# Altium schematic sheet stm32f103.SchDoc
size A4
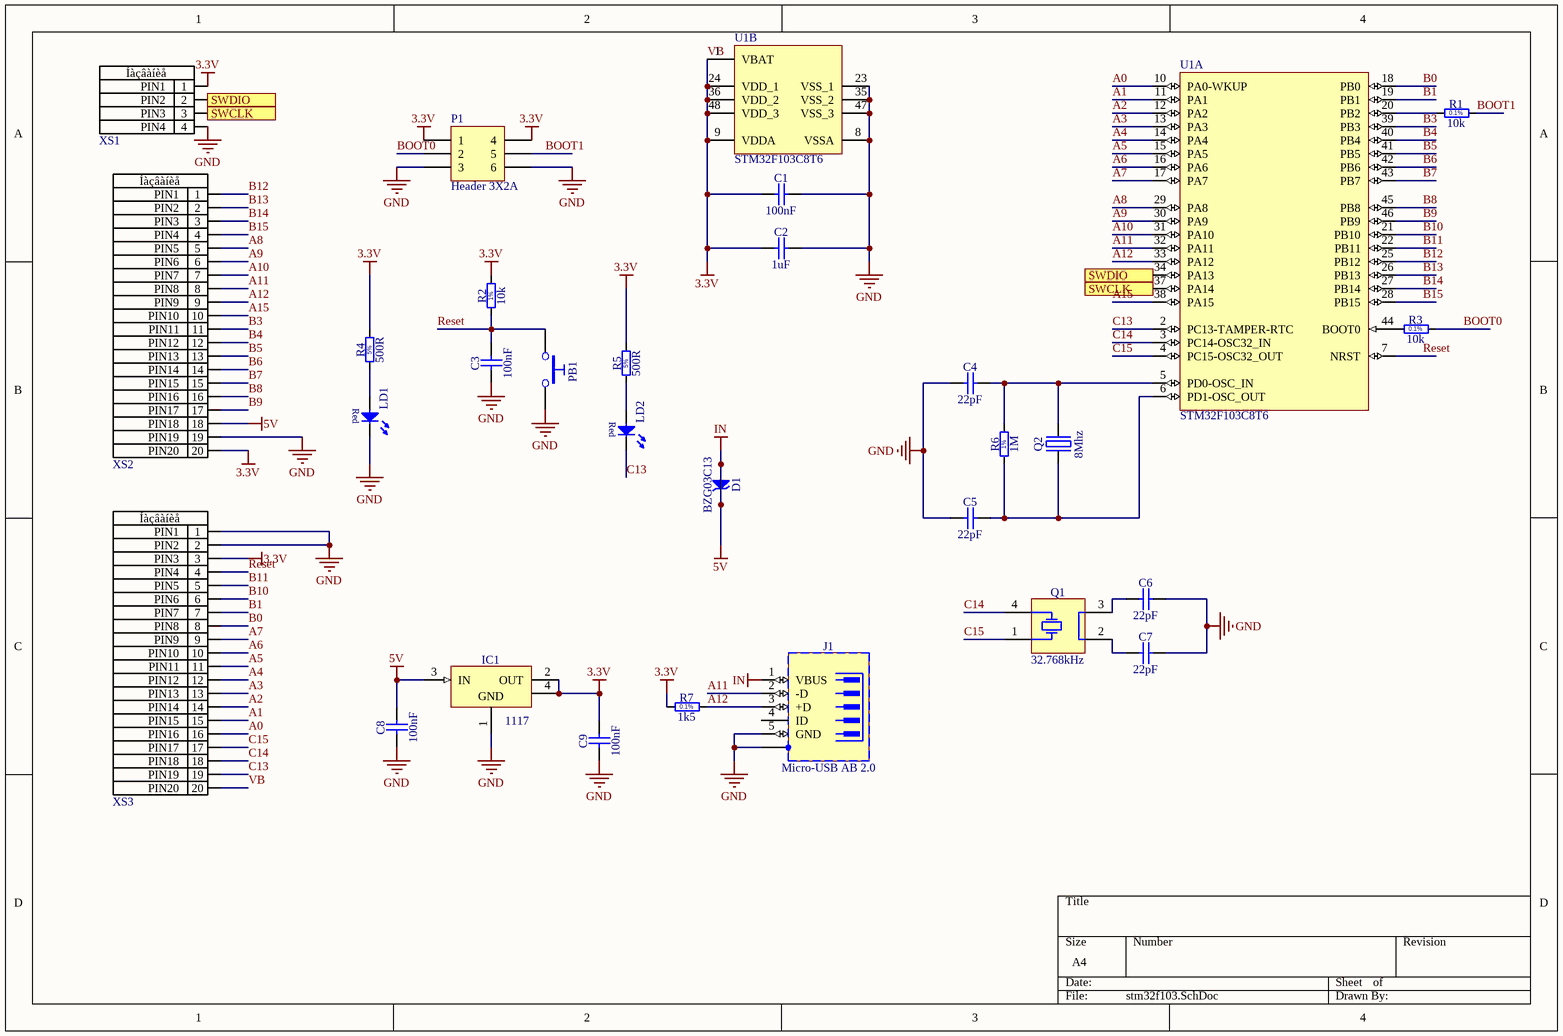
[diagram p0: stm32f103.SchDoc]

## Parts
C1  100nF  [CAPC3216X140N]
C2  1uF  [CAPC3216X140N]
C3  100nF  [CAPC3216X140N]
C4  22pF  [CAPC3216X140N]
C5  22pF  [CAPC3216X140N]
C6  22pF  [CAPC3216X140N]
C7  22pF  [CAPC3216X140N]
C8  100nF  [CAPC3216X140N]
C9  100nF  [CAPC3216X140N]
D1  BZG03C13  [DIOM5326X230N]
IC1  1117  [SOT230P700X180-4N]
J1  Micro-USB AB 2.0  [HIROSE_ZX62RD-AB-5P8(30)]
LD1  Red  [LED_DIALIGHT_597-3111-507F]  (value not drawn)
LD2  Red  [LED_DIALIGHT_597-3111-507F]  (value not drawn)
P1  Header 3X2A  [HDR2X3_CEN]
PB1  Push Button  [PB_TYCO_FSMSM]  (value not drawn)
Q1  32.768kHz  [XTAL_ABRACON_ABS25]
Q2  8Mhz  [XTAL1160X490X430]
R1  10k  [RESC1608X55N]
R2  10k  [RESC1608X55N]
R3  10k  [RESC1608X55N]
R4  500R  [RESC1509X55N]
R5  500R  [RESC1509X55N]
R6  1M  [RESC1608X55N]
R7  1k5  [RESC1608X55N]
U1  STM32F103C8T6  [STM-LQFP48_N]  (parts A,B of 2)
XS1  Name: Íàçâàíèå  [HDR1X4 - WA]  (hidden comment: Ğàçú¸ì PLS-4)
XS2  Name: Íàçâàíèå  [20SIN]  (hidden comment: Ğàçú¸ì PLS-20)
XS3  Name: Íàçâàíèå  [20SIN]  (hidden comment: Ğàçú¸ì PLS-20)

## Ports
SWCLK, SWDIO

## Nets
5V: C8.2 D1.1(C) D1.2(A) IC1.3(IN) J1.1(VBUS) XS2.18(PIN18)  [also labelled IN]
GND: C1.2 C2.2 C3.1 C4.1 C5.1 C6.2 C7.2 C8.1 C9.1 IC1.1(GND) J1.5(GND) J1.6(SH) LD1.1(C) P1.3 P1.6 PB1.2 U1.8(VSSA) U1.23(VSS_1) U1.35(VSS_2) U1.47(VSS_3) XS1.4(PIN4) XS2.19(PIN19) XS3.1(PIN1) XS3.2(PIN2)
VB: C1.1 C2.1 C9.2 IC1.2(OUT) IC1.4(OUT) P1.1 P1.4 R2.2 R4.2 R5.2 R7.1 U1.1(VBAT) U1.9(VDDA) U1.24(VDD_1) U1.36(VDD_2) U1.48(VDD_3) XS1.1(PIN1) XS2.20(PIN20) XS3.3(PIN3) XS3.20(PIN20)  [also labelled 3.3V]
A0: U1.10(PA0-WKUP) XS3.16(PIN16)
A1: U1.11(PA1) XS3.15(PIN15)
A2: U1.12(PA2) XS3.14(PIN14)
A3: U1.13(PA3) XS3.13(PIN13)
A4: U1.14(PA4) XS3.12(PIN12)
A5: U1.15(PA5) XS3.11(PIN11)
A6: U1.16(PA6) XS3.10(PIN10)
A7: U1.17(PA7) XS3.9(PIN9)
A8: U1.29(PA8) XS2.5(PIN5)
A9: U1.30(PA9) XS2.6(PIN6)
A10: U1.31(PA10) XS2.7(PIN7)
A11: J1.2(-D) U1.32(PA11) XS2.8(PIN8)
A12: J1.3(+D) R7.2 U1.33(PA12) XS2.9(PIN9)
A15: U1.38(PA15) XS2.10(PIN10)
B0: U1.18(PB0) XS3.8(PIN8)
B1: U1.19(PB1) XS3.7(PIN7)
B3: U1.39(PB3) XS2.11(PIN11)
B4: U1.40(PB4) XS2.12(PIN12)
B5: U1.41(PB5) XS2.13(PIN13)
B6: U1.42(PB6) XS2.14(PIN14)
B7: U1.43(PB7) XS2.15(PIN15)
B8: U1.45(PB8) XS2.16(PIN16)
B9: U1.46(PB9) XS2.17(PIN17)
B10: U1.21(PB10) XS3.6(PIN6)
B11: U1.22(PB11) XS3.5(PIN5)
B12: U1.25(PB12) XS2.1(PIN1)
B13: U1.26(PB13) XS2.2(PIN2)
B14: U1.27(PB14) XS2.3(PIN3)
B15: U1.28(PB15) XS2.4(PIN4)
BOOT0: P1.2 R3.2
BOOT1: P1.5 R1.2
C13: LD2.1(C) U1.2(PC13-TAMPER-RTC) XS3.19(PIN19)
C14: Q1.4(X) U1.3(PC14-OSC32_IN) XS3.18(PIN18)
C15: Q1.1(X) U1.4(PC15-OSC32_OUT) XS3.17(PIN17)
Reset: C3.2 PB1.1 R2.1 U1.7(NRST) XS3.4(PIN4)
SWCLK: U1.37(PA14) XS1.3(PIN3) ; port SWCLK
SWDIO: U1.34(PA13) XS1.2(PIN2) ; port SWDIO
NetC4_2: C4.2 Q2.2(OSC2) R6.2 U1.5(PD0-OSC_IN)
NetC5_2: C5.2 Q2.1(OSC1) R6.1 U1.6(PD1-OSC_OUT)
NetC6_1: C6.1 Q1.3(GND)
NetC7_1: C7.1 Q1.2(GND)
NetLD1_2: LD1.2(A) R4.1
NetLD2_2: LD2.2(A) R5.1
NetR1_1: R1.1 U1.20(PB2)
NetR3_1: R3.1 U1.44(BOOT0)

Not connected (* = marked no-connect by the designer): J1 4(ID)

## Notes on the sheet
- (in symbol R0603_1K5_0.1%_0.063W_10PPM) 0.1%
- (in symbol R0603_1M_1%_0.1W_100PPM) 1%
- (in symbol R0603_10K_0.1%_0.063W_10PPM) 0.1%
- (in symbol R0603_10K_1%_0.1W_100PPM) 1%
- (in symbol R0603_500M_5%_0.1W_250PPM_OHMITE_HVC) 5%

## Library data of the parts
C1 C3 C8 C9 = CC1206_100NF_50V_10%_X7R: Non-polarised capacitor; Part Description: SMD Multilayer Chip Ceramic Capacitor; Manufacturer: GENERIC; Manufacturer1 Part Number: VJ1206Y104KXAAT; Voltage: 50V; TC: X7R; Tolerance: ±10%; Part Number: CC1206_100NF_50V_10%_X7R; Component Kind: Standard; Component Type: Standard; Pin Count: 2; Value: 100nF; Status: Preferred; Manufacturer Part Number: CC1206_100NF_50V_10%_X7R; Case: 1206; Mounted: Yes; Socket: No; SMD: Yes; Sense: No; Manufacturer1 Example: VISHAY VITRAMON; Manufacturer1 ComponentHeight: 1.7mm; HelpURL: \\cern.ch\dfs\Applications\Altium\Datasheets\CC1206_X7R_VISHAY_VJ.pdf; Author: CERN DEM JLC
  C1 C8 C9: CreateDate: 03.12.2007; LatestRevisionDate: 03.12.2007
  C3: CreateDate: 3.12.2007; LatestRevisionDate: 3.12.2007
C2 = CC1206_1UF_50V_10%_X7R: Non-polarised capacitor; Part Description: SMD Multilayer Chip Ceramic Capacitor; Manufacturer: GENERIC; Manufacturer1 Part Number: C1206F105K5RACTU; Voltage: 50V; TC: X7R; Tolerance: ±10%; Part Number: CC1206_1UF_50V_10%_X7R; Component Kind: Standard; Component Type: Standard; Pin Count: 2; Value: 1uF; Status: Preferred; Manufacturer Part Number: CC1206_1UF_50V_10%_X7R; Case: 1206; Mounted: Yes; Socket: No; SMD: Yes; Sense: No; Manufacturer1 Example: KEMET; Manufacturer1 ComponentHeight: 1.8mm; HelpURL: \\cern.ch\dfs\Applications\Altium\Datasheets\CC1206_X7R_KEMET_OPENMODE.pdf; Author: CERN DEM JLC; CreateDate: 07.11.2012; LatestRevisionDate: 07.11.2012
C4 C5 = CC1206_12PF_50V_5%_NP0: Non-polarised capacitor; Part Description: SMD Multilayer Chip Ceramic Capacitor; Manufacturer: GENERIC; Manufacturer1 Part Number: VJ1206A120JXAAT; Value: 12pF; Voltage: 50V; TC: C0G/NP0; Tolerance: ±5%; Part Number: CC1206_12PF_50V_5%_NP0; Component Kind: Standard; Component Type: Standard; Pin Count: 2; Status: Preferred; Manufacturer Part Number: CC1206_12PF_50V_5%_NP0; Case: 1206; Mounted: Yes; Socket: No; SMD: Yes; Sense: No; Manufacturer1 Example: VISHAY VITRAMON; Manufacturer1 ComponentHeight: 1.7mm; HelpURL: \\cern.ch\dfs\Applications\Altium\Datasheets\CC1206_NP0_VISHAY_VJ.pdf; Author: CERN DEM JLC; CreateDate: 3.12.2007; LatestRevisionDate: 3.12.2007
C6 C7 = CC1206_100PF_50V_5%_NP0: Non-polarised capacitor; Part Description: SMD Multilayer Chip Ceramic Capacitor; Manufacturer: GENERIC; Manufacturer1 Part Number: VJ1206A101JXAAT; Value: 100pF; Voltage: 50V; TC: C0G/NP0; Tolerance: ±5%; Part Number: CC1206_100PF_50V_5%_NP0; Component Kind: Standard; Component Type: Standard; Pin Count: 2; Status: Preferred; Manufacturer Part Number: CC1206_100PF_50V_5%_NP0; Case: 1206; Mounted: Yes; Socket: No; SMD: Yes; Sense: No; Manufacturer1 Example: VISHAY VITRAMON; Manufacturer1 ComponentHeight: 1.7mm; HelpURL: \\cern.ch\dfs\Applications\Altium\Datasheets\CC1206_NP0_VISHAY_VJ.pdf; Author: CERN DEM JLC; CreateDate: 3.12.2007; LatestRevisionDate: 3.12.2007
D1 = BZG03C13: Zener Diode; Part Description: Voltage Regulator Diode; Manufacturer: VISHAY SEMICONDUCTOR; Voltage: 13V; Power: 1.25W; PressFit: No; Bonding: No; Part Number: BZG03C13; Component Kind: Standard; Component Type: Standard; Device: BZG03C13; PackageDescription: DO-214-AC/SMA Molded Diode, Body 5.3x2.6mm, IPC Medium Density; Manufacturer Part Number: BZG03C13; Pin Count: 2; Case: DO-214AC; Mounted: Yes; Socket: No; SMD: Yes; Sense: No; ComponentHeight: 2.3mm; HelpURL: \\cern.ch\dfs\Applications\Altium\Datasheets\BZG03C.pdf; Author: CERN DEM JLC; CreateDate: 02.06.2008; LatestRevisionDate: 02.06.2008
IC1 = ADP3339AKCZ-1.8: 3-Terminal Regulator 1=GND 2=OUT 3=IN 4=OUT; Part Description: 1.8V, 1.5A, High Accuracy, UltraLow Iq, AnyCAP Low Dropout Regulator; Manufacturer: ANALOG DEVICES; PressFit: No; Bonding: No; Part Number: ADP3339AKCZ-1.8; Component Kind: Standard; Component Type: Standard; Device: ADP3339AKCZ-1.8; PackageDescription: SOT223, 2.30mm pitch; 3 pin, 3.70mm W X 6.70mm L, IPC Medium Density; Manufacturer Part Number: ADP3339AKCZ-1.8; Pin Count: 4; Case: SOT223; Mounted: Yes; Socket: No; SMD: Yes; Sense: No; ComponentHeight: 1.8mm; HelpURL: \\cern.ch\dfs\Applications\Altium\Datasheets\ADP3339AKCZ-1.8.pdf; Author: CERN DEM BC; CreateDate: 10.11.2015; LatestRevisionDate: 10.11.2015
J1 = HIROSE_ZX62RD-AB-5P8(30): 5 Pin + 1 Shield USB Receptacle; Part Description: Micro-USB 2.0 Right Angle, SMD Type AB - Reverse (Top mount), Shell Through Hole; Manufacturer: HIROSE (HRS); PressFit: No; Part Number: HIROSE_ZX62RD-AB-5P8(30); Component Kind: Standard; Component Type: Standard; Pin Count: 7; Family: Micro-USB AB 2.0; Mounted: Yes; Socket: No; SMD: Yes; Sense: No; Status: None; Manufacturer Part Number: ZX62RD-AB-5P8(30); ComponentHeight: 2.35mm; HelpURL: \\cern.ch\dfs\Applications\Altium\Datasheets\HIROSE_ZX62RD-AB-5P8(30).pdf; ComponentLink1URL: \\cern.ch\dfs\Applications\Altium\Datasheets\HIROSE_ZX62RD-AB-5P8(30)_Package-Drawing.pdf; ComponentLink1Description: Package-Drawing; Author: CERN DEM JMW; CreateDate: 22.06.2017; LatestRevisionDate: 22.06.2017
LD1 LD2 = LED_DIALIGHT_597-3111-507F: LED Red 1C 2A; Part Description: SMT AlGaAs Red LED, 597 Series; PressFit: No; Bonding: No; Part Number: LED_DIALIGHT_597-3111-507F; Component Kind: Standard; Component Type: Standard; Color: Red; PackageDescription: SMT AlGaAs Red LED,Body 3x1.6mm (1208),  DIALIGHT 597 Serie; Manufacturer: DIALIGHT; Manufacturer Part Number: 597-3111-507F; Pin Count: 2; Mounted: Yes; Socket: No; SMD: Yes; Sense: No; ComponentHeight: 1.5mm; HelpURL: \\cern.ch\dfs\Applications\Altium\Datasheets\LED_DIALIGHT_597-3111-507F.pdf; Author: CERN DEM JLC; CreateDate: 26.10.2011; LatestRevisionDate: 26.10.2011
P1 = Header 3X2A: Header, 3-Pin, Dual row; LatestRevisionDate: 17-Jul-2002; LatestRevisionNote: Re-released for DXP Platform.; Publisher: Altium Limited
PB1 = PB_TYCO_FSMSM: Push-Button Switch SPDT; Part Description: 12VDC 50mA SPST Tactile  Push-Button Switch; Manufacturer: TYCO ELECTRONICS; Manufacturer Part Number: FSMSM or 1437566-3; PressFit: No; Part Number: PB_TYCO_FSMSM; Component Kind: Standard; Component Type: Standard; Pin Count: 2; PackageDescription: Body 3.5x6.0mm, Pushbutton Switch,  TYCO ALCOSWITCH FSMSM Serie; Family: Push Button; Mounted: Yes; Socket: No; SMD: Yes; Sense: No; Status: None; ComponentHeight: 4.3mm; HelpURL: \\cern.ch\dfs\Applications\Altium\Datasheets\PB_TYCO_FSMSM.pdf; Author: CERN DEM JLC; CreateDate: 30.06.2008; LatestRevisionDate: 21.06.2012
Q1 = XTAL_32.768KHZ_ABRACON_ABS25-32.768KHZ-T: Crystal 4 pins 1=XTAL Control 2 And 3=NC 4=XTAL; Part Description: Tolerance: ±20ppm, -40°C to +85°C, 12.5pF, SMD Crystal, ABS25 Series; PressFit: No; Bonding: No; Part Number: XTAL_32.768KHZ_ABRACON_ABS25-32.768KHZ-T; Component Kind: Standard; Component Type: Standard; PackageDescription: 4 Pins, 8mm L X 3.8mm W X 2.7mm H, SMD Crystal, ABS25 Serie; Value: 32.768kHz; Manufacturer: ABRACON; Manufacturer Part Number: ABS25-32.768KHZ-T; Pin Count: 4; Mounted: Yes; Socket: No; SMD: Yes; Sense: No; ComponentHeight: 2.7mm; HelpURL: \\cern.ch\dfs\Applications\Altium\Datasheets\XTAL_ABRACON_ABS25.pdf; Author: CERN DEM JMW; CreateDate: 15.07.2015; LatestRevisionDate: 15.07.2015
Q2 = XTAL_10MHZ_IQD_LFXTAL003166: Quartz Crystal; Part Description: Tolerance:± 30ppm, Stability:± 50ppm, -10°C to +60°C, 16pF, Surface Mount Quartz Crystal, HC49/4HSMX Series; Manufacturer: IQD FREQUENCY PRODUCTS; Value: 10MHz; PressFit: No; Bonding: No; Part Number: XTAL_10MHZ_IQD_LFXTAL003166; Component Kind: Standard; Component Type: Standard; PackageDescription: HC49/4H SMX Case, SMD Cristal, Body 11.6x4.9mm; Manufacturer Part Number: LF XTAL003166; Pin Count: 2; Mounted: Yes; Socket: No; SMD: Yes; Sense: No; ComponentHeight: 4.3mm; HelpURL: \\cern.ch\dfs\Applications\Altium\Datasheets\XTAL_IQD_LFXTAL003166.pdf; Author: CERN DEM JLC; CreateDate: 19.04.2012; LatestRevisionDate: 07.11.2016
R1 R3 = R0603_10K_0.1%_0.063W_10PPM: Resistor - 0.1%; Part Description: Thin Film Chip Resistor; Manufacturer: GENERIC; Manufacturer1 Part Number: RN73C1J10KBTDF; Power: 0.063W; TC: ±10ppm; PressFit: No; Part Number: R0603_10K_0.1%_0.063W_10PPM; Component Kind: Standard; Component Type: Standard; Pin Count: 2; Value: 10k; Status: Not Recommended; Tolerance: ±0.1%; Manufacturer Part Number: R0603_10K_0.1%_0.063W_10PPM; Case: 0603; Mounted: Yes; Sense: No; Socket: No; SMD: Yes; Manufacturer1 Example: TYCO HOLSWORTHY; Manufacturer1 ComponentHeight: 0.5mm; HelpURL: \\cern.ch\dfs\Applications\Altium\Datasheets\R0603_Tyco_RN73.pdf; Author: CERN DEM JLC; CreateDate: 03.12.2007; LatestRevisionDate: 13.03.2008
R2 = R0603_10K_1%_0.1W_100PPM: Resistor - 1%; Part Description: General Purpose Thick Film Chip Resistor; Manufacturer: GENERIC; Manufacturer1 Part Number: NRC06F1002TRF; Power: 0.1W; TC: ±100ppm/°C; PressFit: No; Part Number: R0603_10K_1%_0.1W_100PPM; Component Kind: Standard; Component Type: Standard; Pin Count: 2; Value: 10k; Status: Preferred; Tolerance: ±1%; Manufacturer Part Number: R0603_10K_1%_0.1W_100PPM; Case: 0603; Mounted: Yes; Sense: No; Socket: No; SMD: Yes; Manufacturer1 Example: NIC COMPONENT; Manufacturer1 ComponentHeight: 0.55mm; HelpURL: \\cern.ch\dfs\Applications\Altium\Datasheets\R0603_NIC_NRC.pdf; Author: CERN DEM JLC; CreateDate: 3.12.2007; LatestRevisionDate: 13.03.2008
R4 R5 = R0603_500M_5%_0.1W_250PPM_OHMITE_HVC: Resistor - 5%; Part Description: High-Value High-voltage (150V) Wraparound Chip Resistor; Manufacturer: OHMITE; Manufacturer Part Number: HVC0603Z5006JE; Value: 500M; Power: 0.1W; TC: ±250ppm/°C; PressFit: No; Part Number: R0603_500M_5%_0.1W_250PPM_OHMITE_HVC; Component Kind: Standard; Component Type: Standard; Pin Count: 2; Status: None; Tolerance: ±5%; Case: 0603; Mounted: Yes; Sense: No; Socket: No; SMD: Yes; ComponentHeight: 0.55mm; HelpURL: \\cern.ch\dfs\Applications\Altium\Datasheets\R0603_OHMITE_HVC.pdf; Author: CERN DEM JLC; CreateDate: 03.06.2015; LatestRevisionDate: 03.06.2015
R6 = R0603_1M_1%_0.1W_100PPM: Resistor - 1%; Part Description: General Purpose Thick Film Chip Resistor; Manufacturer: GENERIC; Manufacturer1 Part Number: NRC06F1004TRF; Power: 0.1W; TC: ±100ppm/°C; PressFit: No; Part Number: R0603_1M_1%_0.1W_100PPM; Component Kind: Standard; Component Type: Standard; Pin Count: 2; Value: 1M; Status: Preferred; Tolerance: ±1%; Manufacturer Part Number: R0603_1M_1%_0.1W_100PPM; Case: 0603; Mounted: Yes; Sense: No; Socket: No; SMD: Yes; Manufacturer1 Example: NIC COMPONENT; Manufacturer1 ComponentHeight: 0.55mm; HelpURL: \\cern.ch\dfs\Applications\Altium\Datasheets\R0603_NIC_NRC.pdf; Author: CERN DEM JLC; CreateDate: 03.12.2007; LatestRevisionDate: 13.03.2008
R7 = R0603_1K5_0.1%_0.063W_10PPM: Resistor - 0.1%; Part Description: Thin Film Chip Resistor; Manufacturer: GENERIC; Manufacturer1 Part Number: RN73C1J1K5BTDF; Power: 0.063W; TC: ±10ppm; PressFit: No; Part Number: R0603_1K5_0.1%_0.063W_10PPM; Component Kind: Standard; Component Type: Standard; Pin Count: 2; Value: 1k5; Status: Not Recommended; Tolerance: ±0.1%; Manufacturer Part Number: R0603_1K5_0.1%_0.063W_10PPM; Case: 0603; Mounted: Yes; Sense: No; Socket: No; SMD: Yes; Manufacturer1 Example: TYCO HOLSWORTHY; Manufacturer1 ComponentHeight: 0.5mm; HelpURL: \\cern.ch\dfs\Applications\Altium\Datasheets\R0603_Tyco_RN73.pdf; Author: CERN DEM JLC; CreateDate: 03.12.2007; LatestRevisionDate: 13.03.2008
U1 = STM32F103C8T6: ARM Cortex-M3 32-bit MCU, 64 KB Flash, 20 KB Internal RAM, 37 I/Os, 48-pin LQFP, -40 to 85 degC, Tray; A/D Converter: 2x12-bit (10 Channel); FLASH Size (Prog) (kB): 64; I/Os (High Current): 37; Internal RAM Size (kB): 20; Operating Frequency(F) (Processor speed) (MHz): 72; Supply Voltage(Vcc) min (V): 2; DatasheetVersion: Rev. 16; PackageVersion: Rev. 6, 06/2013; PackageReference: LQFP48; PackageDescription: 48-Pin Low Profile Quad Flat Package, 7 x 7 mm Body, 0.5 mm Pitch; Supplier 1: Digi-Key; Supplier Part Number 1: 497-6063-ND; Supplier 2: Farnell; Supplier Part Number 2: 1447637; Supplier 3: Newark; Supplier Part Number 3: 59M2182; Supplier 4: Newark; Supplier Part Number 4: 57P1222; Supplier 5: Mouser; Supplier Part Number 5: 511-STM32F103C8T6; Core: ARM Cortex-M3; Packing: Tray; Mounting Technology: Surface Mount; PartNumber: STM32F103C8T6; ComponentLink1Description: Manufacturer URL; ComponentLink1URL: http://www.st.com/web/en/home.html; ComponentLink2Description: Datasheet; ComponentLink2URL: http://www.st.com/st-web-ui/static/active/en/resource/technical/document/datasheet/CD00161566.pdf; ComponentLink3Description: Package Specification; ComponentLink3URL: http://www.st.com/st-web-ui/static/active/en/resource/technical/document/datasheet/DM00058181.pdf
XS1 = HDR 1x4: Male, 4 pin single in line, 2.54; ComponentLink1Description: Ñàéò ïğîèçâîäèòåëÿ; ComponentLink2Description: Datasheet; Device: PLS-4; Family: Ğàçú¸ì; ComponentLink3Description: Ãäå êóïèòü?
XS2 XS3 = HDR 1x20: Male, 20 pin single in line, 2.54; ComponentLink1Description: Ñàéò ïğîèçâîäèòåëÿ; ComponentLink2Description: Datasheet; Device: PLS-20; Family: Ğàçú¸ì; ComponentLink3Description: Ãäå êóïèòü?